# EAGLE schematic xmega-a3u-header (EAGLE 7.6.0)
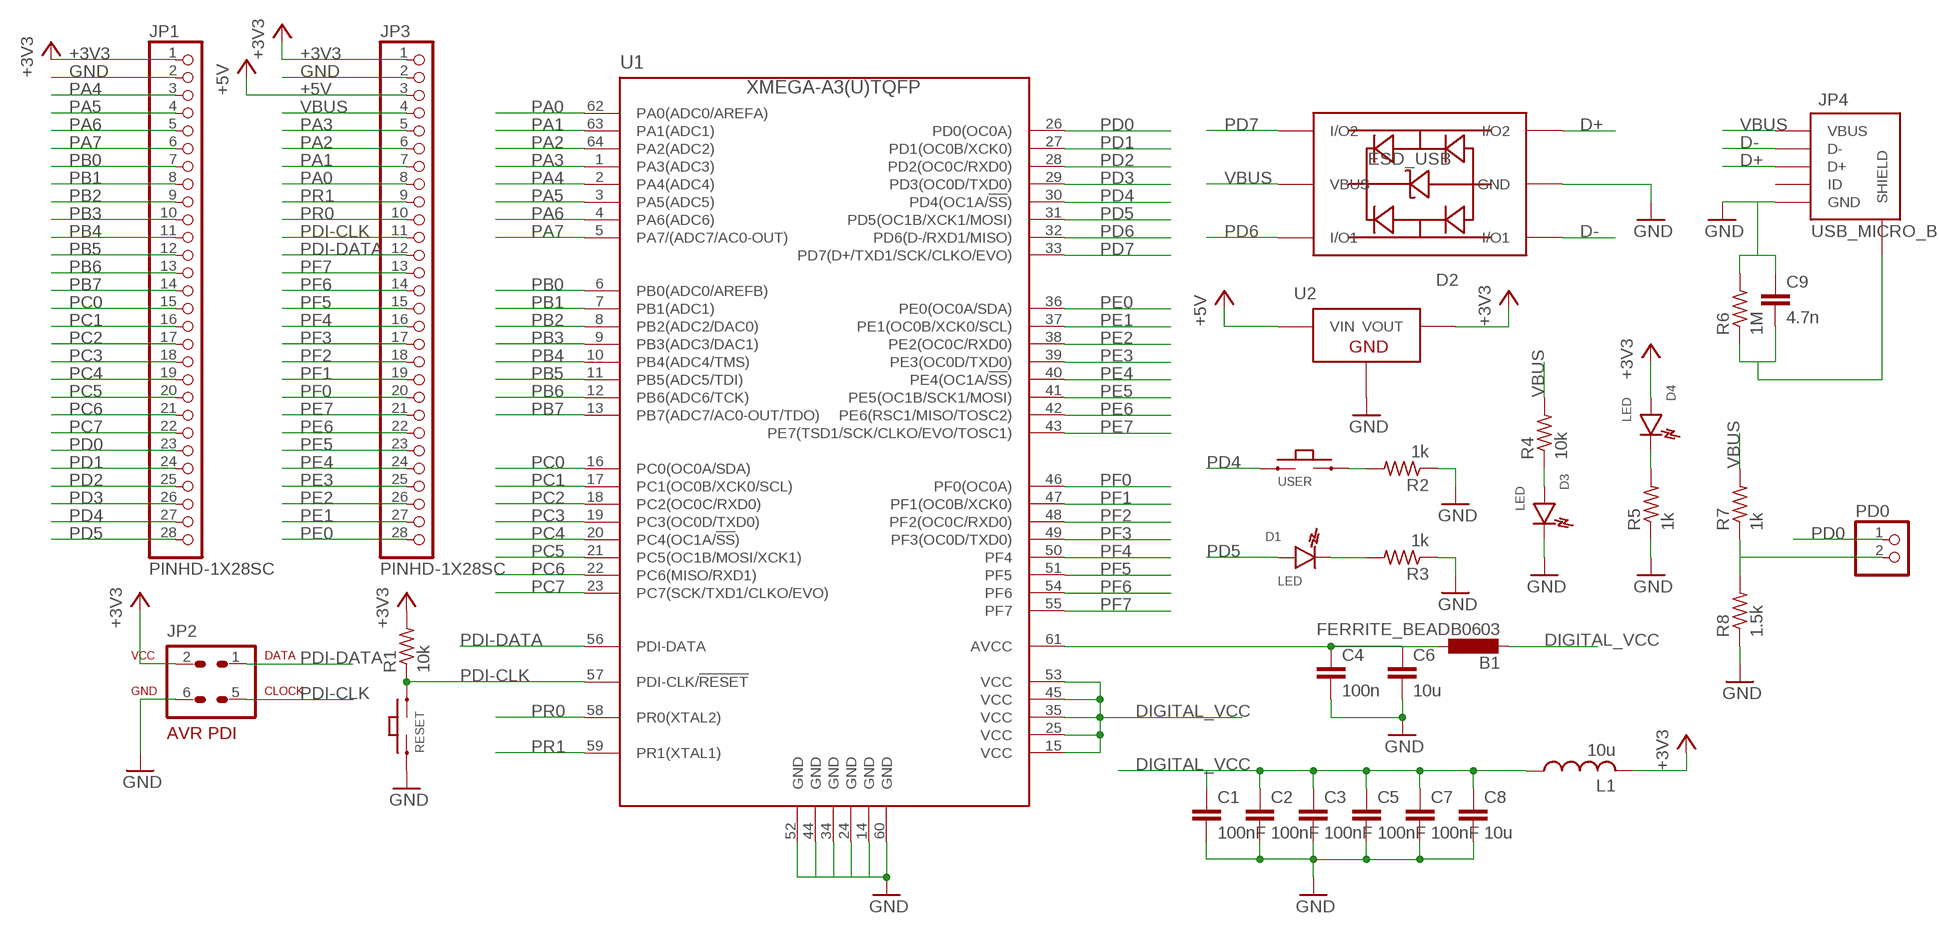
[diagram p0: schematic, sheet 1]

## Parts
B1  FERRITE_BEADB0603  [B0603]
C1  100nF  C-EUC1206  [C1206]
C2  100nF  C-EUC1206  [C1206]
C3  100nF  C-EUC1206  [C1206]
C4  100n  C-EUC1206  [C1206]
C5  100nF  C-EUC1206  [C1206]
C6  10u  C-EUC1206  [C1206]
C7  100nF  C-EUC1206  [C1206]
C8  10u  C-EUC1206  [C1206]
C9  4.7n  C-EUC1206  [C1206]
D1  LED  [1210K]
D2  ESD_USB  [SOT23-6]
D3  LED  [1210K]
D4  LED  [1210K]
JP1  PINHD-1X28SC  [1X28C]
JP2  AVR-PDIVERT  [AVR-ISP-6]
JP3  PINHD-1X28SC  [1X28C]
JP4  USB_MICRO_B  [USB3076-30-A]
L1  10u  L-USL0603  [L0603]
PD0  PINHD-1X2  [1X02]
R1  10k  R-US_R1206  [R1206]
R2  1k  R-US_R1206  [R1206]
R3  1k  R-US_R1206  [R1206]
R4  10k  R-US_R1206  [R1206]
R5  1k  R-US_R1206  [R1206]
R6  1M  R-US_R1206  [R1206]
R7  1k  R-US_R1206  [R1206]
R8  1.5k  R-US_R1206  [R1206]
RESET  TACTILE-BUTTONSMD-2PIN  [FSMSM]
U1  XMEGA-A3(U)TQFP  [TQFP64]
U2  AMS1117  [SOT223TAB]
USER  TACTILE-BUTTONSMD-2PIN  [FSMSM]

## Nets
1: C9.2 JP4.BIG_PAD_LEFT(SHIELD) JP4.BIG_PAD_RIGHT(SHIELD) JP4.MECH_RIGHT(SHIELD) JP4.PAD_LEFT(SHIELD) JP4.PAD_RIGHT(SHIELD) JP4.SHIELD_LEFT(SHIELD) R6.1
+3V3: D4.POS JP1.1 JP2.2 JP3.1 L1.2 R1.2 U2.2(VOUT) U2.4(VOUT)
+5V: JP3.3 U2.3(VIN)
D+: D2.3(I/O2) JP4.D+
D-: D2.1(I/O1) JP4.D-
DIGITAL_VCC: B1.2 C1.1 C2.1 C3.1 C5.1 C7.1 C8.1 L1.1 U1.15(VCC) U1.25(VCC) U1.35(VCC) U1.45(VCC) U1.53(VCC)
GND: C1.2 C2.2 C3.2 C4.2 C5.2 C6.2 C7.2 C8.2 C9.1 D2.2(GND) D3.NEG JP1.2 JP2.6 JP3.2 JP4.GND R2.1 R3.1 R5.1 R6.2 R8.1 RESET.1 U1.14(GND) U1.24(GND) U1.34(GND) U1.44(GND) U1.52(GND) U1.60(GND) U2.1(GND)
N$1: D3.POS R4.1
N$2: B1.1 C4.1 C6.1 U1.61(AVCC)
N$3: R2.2 USER.2
N$4: D4.NEG R5.2
N$5: D1.NEG R3.2
N$6: PD0.2 R7.1 R8.2
PA0: JP3.8 U1.62(PA0(ADC0/AREFA))
PA1: JP3.7 U1.63(PA1(ADC1))
PA2: JP3.6 U1.64(PA2(ADC2))
PA3: JP3.5 U1.1(PA3(ADC3))
PA4: JP1.3 U1.2(PA4(ADC4))
PA5: JP1.4 U1.3(PA5(ADC5))
PA6: JP1.5 U1.4(PA6(ADC6))
PA7: JP1.6 U1.5(PA7/(ADC7/AC0-OUT))
PB0: JP1.7 U1.6(PB0(ADC0/AREFB))
PB1: JP1.8 U1.7(PB1(ADC1))
PB2: JP1.9 U1.8(PB2(ADC2/DAC0))
PB3: JP1.10 U1.9(PB3(ADC3/DAC1))
PB4: JP1.11 U1.10(PB4(ADC4/TMS))
PB5: JP1.12 U1.11(PB5(ADC5/TDI))
PB6: JP1.13 U1.12(PB6(ADC6/TCK))
PB7: JP1.14 U1.13(PB7(ADC7/AC0-OUT/TDO))
PC0: JP1.15 U1.16(PC0(OC0A/SDA))
PC1: JP1.16 U1.17(PC1(OC0B/XCK0/SCL))
PC2: JP1.17 U1.18(PC2(OC0C/RXD0))
PC3: JP1.18 U1.19(PC3(OC0D/TXD0))
PC4: JP1.19 U1.20(PC4(OC1A/!SS!))
PC5: JP1.20 U1.21(PC5(OC1B/MOSI/XCK1))
PC6: JP1.21 U1.22(PC6(MISO/RXD1))
PC7: JP1.22 U1.23(PC7(SCK/TXD1/CLKO/EVO))
PD0: JP1.23 PD0.1 U1.26(PD0(OC0A))
PD1: JP1.24 U1.27(PD1(OC0B/XCK0))
PD2: JP1.25 U1.28(PD2(OC0C/RXD0))
PD3: JP1.26 U1.29(PD3(OC0D/TXD0))
PD4: JP1.27 U1.30(PD4(OC1A/!SS!)) USER.1
PD5: D1.POS JP1.28 U1.31(PD5(OC1B/XCK1/MOSI))
PD6: D2.6(I/O1) U1.32(PD6(D-/RXD1/MISO))
PD7: D2.4(I/O2) U1.33(PD7(D+/TXD1/SCK/CLKO/EVO))
PDI-CLK: JP2.5 JP3.11 R1.1 RESET.2 U1.57(PDI-CLK/!RESET)
PDI-DATA: JP2.1 JP3.12 U1.56(PDI-DATA)
PE0: JP3.28 U1.36(PE0(OC0A/SDA))
PE1: JP3.27 U1.37(PE1(OC0B/XCK0/SCL))
PE2: JP3.26 U1.38(PE2(OC0C/RXD0))
PE3: JP3.25 U1.39(PE3(OC0D/TXD0))
PE4: JP3.24 U1.40(PE4(OC1A/!SS!))
PE5: JP3.23 U1.41(PE5(OC1B/SCK1/MOSI))
PE6: JP3.22 U1.42(PE6(RSC1/MISO/TOSC2))
PE7: JP3.21 U1.43(PE7(TSD1/SCK/CLKO/EVO/TOSC1))
PF0: JP3.20 U1.46(PF0(OC0A))
PF1: JP3.19 U1.47(PF1(OC0B/XCK0))
PF2: JP3.18 U1.48(PF2(OC0C/RXD0))
PF3: JP3.17 U1.49(PF3(OC0D/TXD0))
PF4: JP3.16 U1.50(PF4)
PF5: JP3.15 U1.51(PF5)
PF6: JP3.14 U1.54(PF6)
PF7: JP3.13 U1.55(PF7)
PR0: JP3.10 U1.58(PR0(XTAL2))
PR1: JP3.9 U1.59(PR1(XTAL1))
VBUS: D2.5(VBUS) JP3.4 JP4.VBUS R4.2 R7.2
Unconnected: JP4.ID

## Library data of the parts
B1 = USB-req:FERRITE_BEAD
C1-C9 = rcl:C-EU: CAPACITOR, European symbol
D1 D3 D4 = USB-req:LED
D2 = USB-req:ESD_USB
JP1 JP3 = pinhead:PINHD-1X28
JP2 = avr-7:AVR-PDI: AVR PDI programming interface connector
JP4 = USB-req:USB_MICRO_B
L1 = rcl:L-US: INDUCTOR, American symbol
PD0 = pinhead:PINHD-1X2: PIN HEADER
R1-R8 = resistor:R-US_: RESISTOR, American symbol
RESET USER = USB-req:TACTILE-BUTTON
U1 = avr-7:XMEGA-A3(U): Atmel XMega A3/A3U series processor
U2 = USB-req:AMS1117: Voltage Regulator